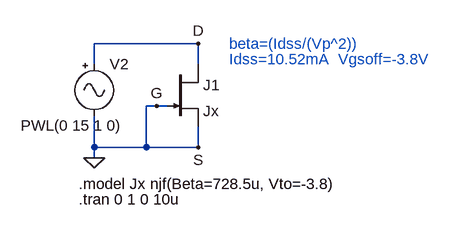
[diagram p0: schematic CircuitoPrimieraParte.asc]
CircuitoPrimieraParte.asc, the LTspice schematic file:
Version 4
SHEET 1 880 680
WIRE 224 80 64 80
WIRE 64 112 64 80
WIRE 224 112 224 80
WIRE 160 176 144 176
WIRE 176 176 160 176
WIRE 64 240 64 192
WIRE 144 240 144 176
WIRE 144 240 64 240
WIRE 224 240 224 208
WIRE 224 240 144 240
WIRE 64 256 64 240
FLAG 64 256 0
FLAG 224 80 D
FLAG 224 240 S
FLAG 160 176 G
SYMBOL njf 176 112 R0
SYMATTR InstName J1
SYMATTR Value Jx
SYMBOL Misc\\signal 64 96 R0
WINDOW 3 -113 110 Left 2
WINDOW 123 0 0 Left 0
WINDOW 39 0 0 Left 0
SYMATTR Value PWL(0 15 1 0)
SYMATTR InstName V2
TEXT 40 320 Left 2 !.tran 0 1 0 10u
TEXT 40 296 Left 2 !.model Jx njf(Beta=728.5u, Vto=-3.8)
TEXT 272 80 Left 2 ;beta=(Idss/(Vp^2))
TEXT 272 104 Left 2 ;Idss=10.52mA  Vgsoff=-3.8V

The netlist it stands for:
* CircuitoPrimieraParte.asc
J1 D 0 0 Jx
V2 D 0 PWL(0 15 1 0)
.model NJF NJF
.model PJF PJF
.lib standard.jft
.tran 0 1 0 10u
.model Jx njf(Beta=728.5u, Vto=-3.8)
* beta=(Idss/(Vp^2))
* Idss=10.52mA  Vgsoff=-3.8V
.backanno
.end